# EAGLE design power-supply (EAGLE 6.6.0)
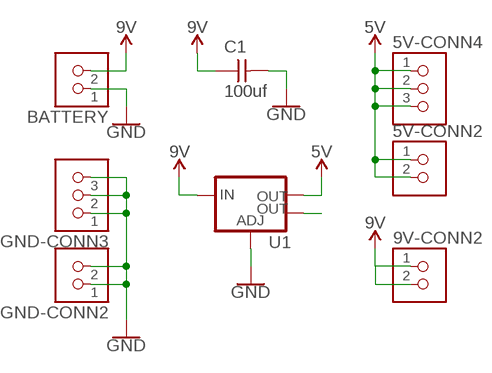
[diagram p0: schematic, sheet 1]

## Parts
5V-CONN2  TERM-1X02-FABLAB  [ED555DS-2DS]
5V-CONN4  TERM-1X03'-FABLAB'  [ED555DS-3DS]
9V-CONN2  TERM-1X02-FABLAB  [ED555DS-2DS]
BATTERY  TERM-1X02-FABLAB  [ED555DS-2DS]
C1  100uf  CAP-UNPOLARIZEDFAB  [C1206FAB]
GND-CONN2  TERM-1X02-FABLAB  [ED555DS-2DS]
GND-CONN3  TERM-1X03'-FABLAB'  [ED555DS-3DS]
U1  V_REG_LM1117SOT223  [SOT223]

## Nets
5V: 5V-CONN2.1 5V-CONN2.2 5V-CONN4.1 5V-CONN4.2 5V-CONN4.3 U1.2(OUT)
9V: 9V-CONN2.1 9V-CONN2.2 BATTERY.2 C1.1 U1.3(IN)
GND: BATTERY.1 C1.2 GND-CONN2.1 GND-CONN2.2 GND-CONN3.1 GND-CONN3.2 GND-CONN3.3 U1.1(ADJ)
N$10: U1.4(OUT)

## Library data of the parts
5V-CONN2 9V-CONN2 BATTERY GND-CONN2 = fab:TERM-1X02: 3.5mm terminal block, 2 positions ED555-2DS as found in the fablab inventory. Stolen from Adafruit <http://www.ladyada.net/library/pcb/eaglelibrary.html>, adapted by Zaerc.
5V-CONN4 GND-CONN3 = fab:TERM-1X03: 3.5mm terminal block, 3 positions ED555-3DS as found in the fablab inventory. Made by Zaerc.
C1 = fab:CAP-UNPOLARIZED
U1 = fab:V_REG_LM1117: Voltage Regulator LM1117 Standard adjustable voltage regulator but in SMD form. Spark Fun Electronics SKU : COM-00595; PROD_ID: VREG-08170

## Board
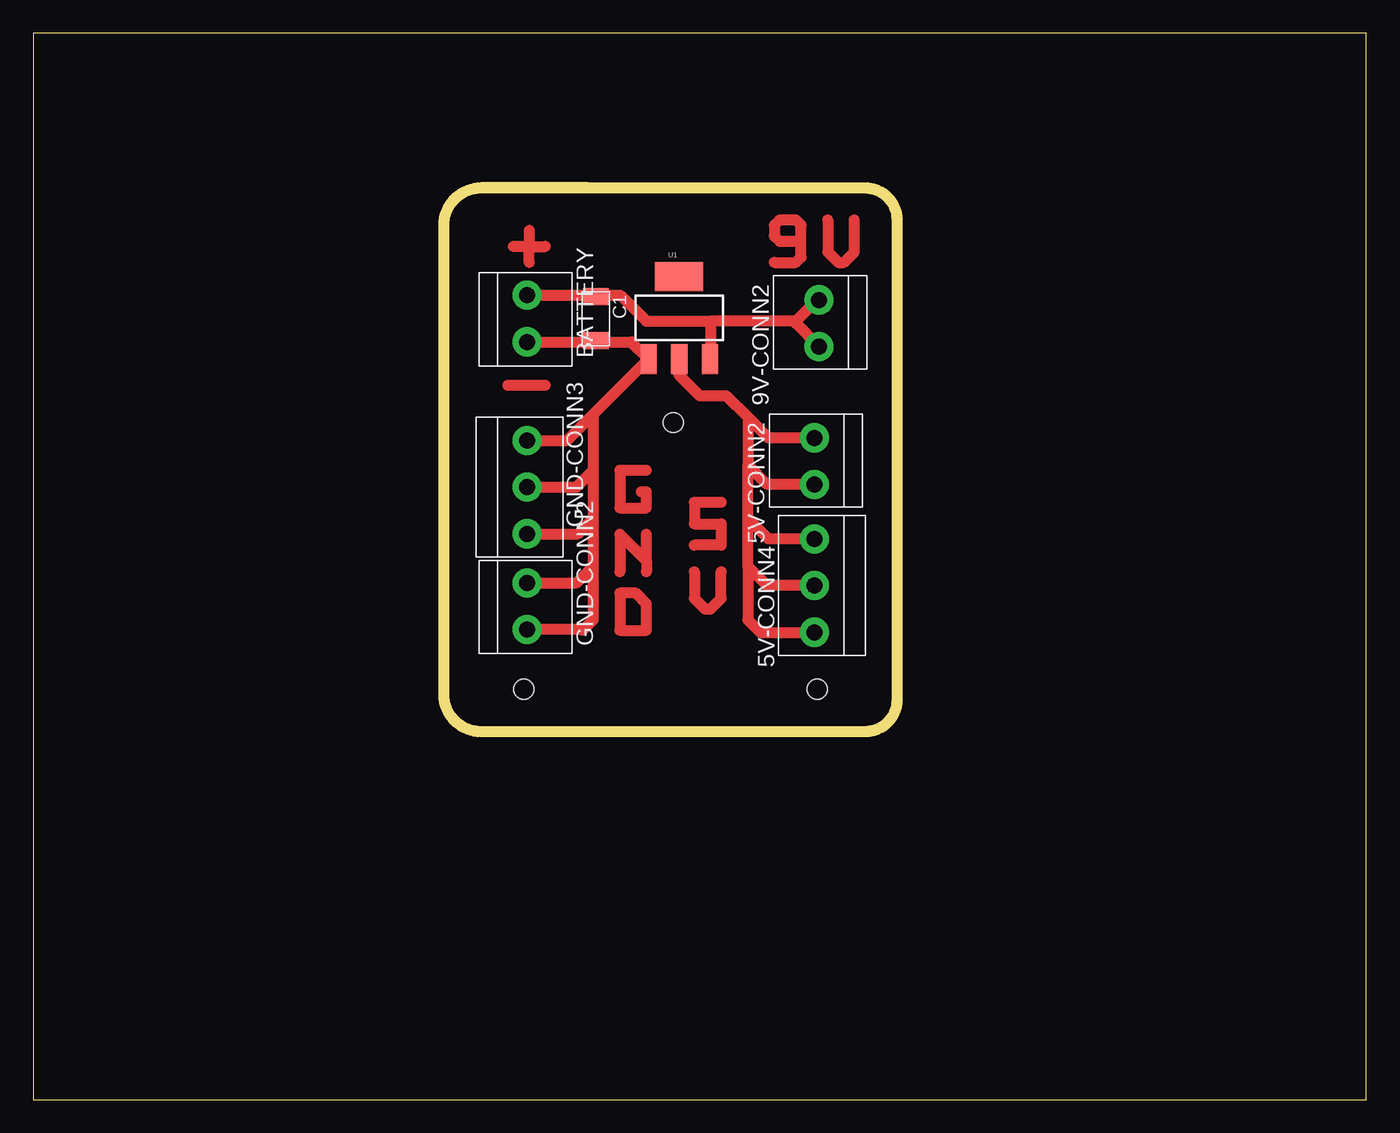
[diagram p1: board, top side]

Size 100 x 80 mm. Coordinates in mm from the lower left corner, seen from the top.
Outline: 0,0 100,0 100,80 0,80 0,0
Copper layers (1*16): Top 0.035mm / dielectric 1.5mm / Bottom 0.035mm
Design rules "default *": minimum track width 6mil, minimum drill 0.35mm, track to track 0.4mm, track to pad 0.4mm, pad to pad 0.4mm, via to via 0.4mm, smd to smd 6mil, copper to edge 40mil, drill to drill 6mil, minimum pad ring 10mil, minimum via ring 8mil, stop-mask expansion 4mil, vias tented up to drill 0mil, thermal gap 10mil
Holes 1.5 mm at 36.8,30.8 58.8,30.8 48,50.8
Milling: area 30.8,27.6 to 64.8,68.4

### Footprints (pad centres in the part's own frame; a part is rotated, then mirrored left to right if it is on the bottom)
ED555DS-2DS = drill 1.2 pad 2.184: 1 1.8,0; 2 -1.7,0
ED555DS-3DS = drill 1.2 pad 2.184: 1 -3.5,0; 2 0,0; 3 3.5,0
C1206FAB = smd 1.27 x 1.905: 1 -1.651,0; 2 1.651,0
SOT223 = smd 1.219 x 2.235: 1 -2.311,-3.099; 2 0,-3.099; 3 2.311,-3.099 | smd 3.6 x 2.2: 4 0,3.099

### Placement (x,y rotation side)
5V-CONN2  58.62,47.85 90 top
5V-CONN4  58.62,38.56 90 top
9V-CONN2  58.94,58.2 90 top
BATTERY  37.03,58.65 270 top
C1  42.2,58.6 270 top
GND-CONN2  37.03,37.06 270 top
GND-CONN3  37.03,45.95 270 top
U1  48.46,58.65 0 top

### Tracks (layer width: path | path; a pad name or v marks a point on that pad's centre or on a via)
5V
  Top 0.813: 53.6,40 53.6,43.6 | 53.6,43.6 53.6,47.6 | 5V-CONN4.2 55.04,38.56 53.6,40 | 53.6,40 53.6,36 54.54,35.06 5V-CONN4.1 | 5V-CONN4.3 55.14,42.06 53.6,43.6 | 5V-CONN2.2 55.05,46.15 53.6,47.6 | 5V-CONN2.1 55.15,49.65 53.6,51.2 | 53.6,51.2 53.6,47.6 | 53.6,51.2 52,52.8 50,52.8 48.46,54.34 U1.2
9V
  Top 0.152: 44,60.4 43.85,60.25 C1.1 43.95,60.25 44.05,60.35
  Top 0.813: BATTERY.2 44.05,60.35 46,58.4 50.8,58.4 | 50.8,58.4 50.8,55.58 U1.3 | 9V-CONN2.2 57.2,58.24 57.2,58.4 | 57.2,58.4 50.8,58.4 | 9V-CONN2.1 58.8,60 57.2,58.4
GND
  Top 0.152: C1.2 42.3,56.95 42.4,56.85
  Top 0.813: BATTERY.1 42.4,56.85 44.85,56.85 U1.1 42,51.4 | GND-CONN2.1 41.14,35.26 41.2,35.2 42,36 42,40 | 42,51.4 42,47.2 | 42,47.2 42,43.6 | 42,43.6 42,40 | GND-CONN2.2 40.76,38.76 42,40 | GND-CONN3.3 40.85,42.45 42,43.6 | GND-CONN3.2 40.75,45.95 42,47.2 | GND-CONN3.1 40.05,49.45 42,51.4
N$1
  Top 0.813: 46,47.2 44,47.2 44,44.4 46,44.4 46,45.6 45.6,45.6
N$2
  Top 0.813: 44,39.6 44,42.4 46,40.4 | 46,40.4 46,39.6 | 46,40.4 46,42.4
N$3
  Top 0.813: 44,38 44,35.2 46,35.2 46,37.2 45.2,38 44,38
N$4
  Top 0.813: 51.6,44.8 49.6,44.8 49.6,43.2 51.6,43.2 51.6,41.6 49.6,41.6
N$5
  Top 0.813: 49.6,39.6 49.6,37.6 50.4,36.8 50.8,36.8 51.6,37.6 51.6,39.6
N$6
  Top 0.813: 35.6,53.6 38.4,53.6
N$7
  Top 0.813: 37.2,62.8 37.2,64 | 37.2,65.2 37.2,64 | 37.2,64 36,64 | 37.2,64 38.4,64
N$8
  Top 0.813: 55.6,62.8 57.2,62.8 57.6,63.2 57.6,65.6 57.2,66 56,66 55.6,65.6 55.6,64.8 56,64.4 57.2,64.4
N$9
  Top 0.813: 59.6,66 59.6,63.6 60.4,62.8 60.8,62.8 61.6,63.6 61.6,66
N$11  (via drill 1)
  other vias: 48,50.8
N$12  (via drill 1)
  other vias: 36.8,30.8
N$13  (via drill 1)
  other vias: 58.8,30.8